# EAGLE design Mainboard 12-13 (EAGLE 5.11)
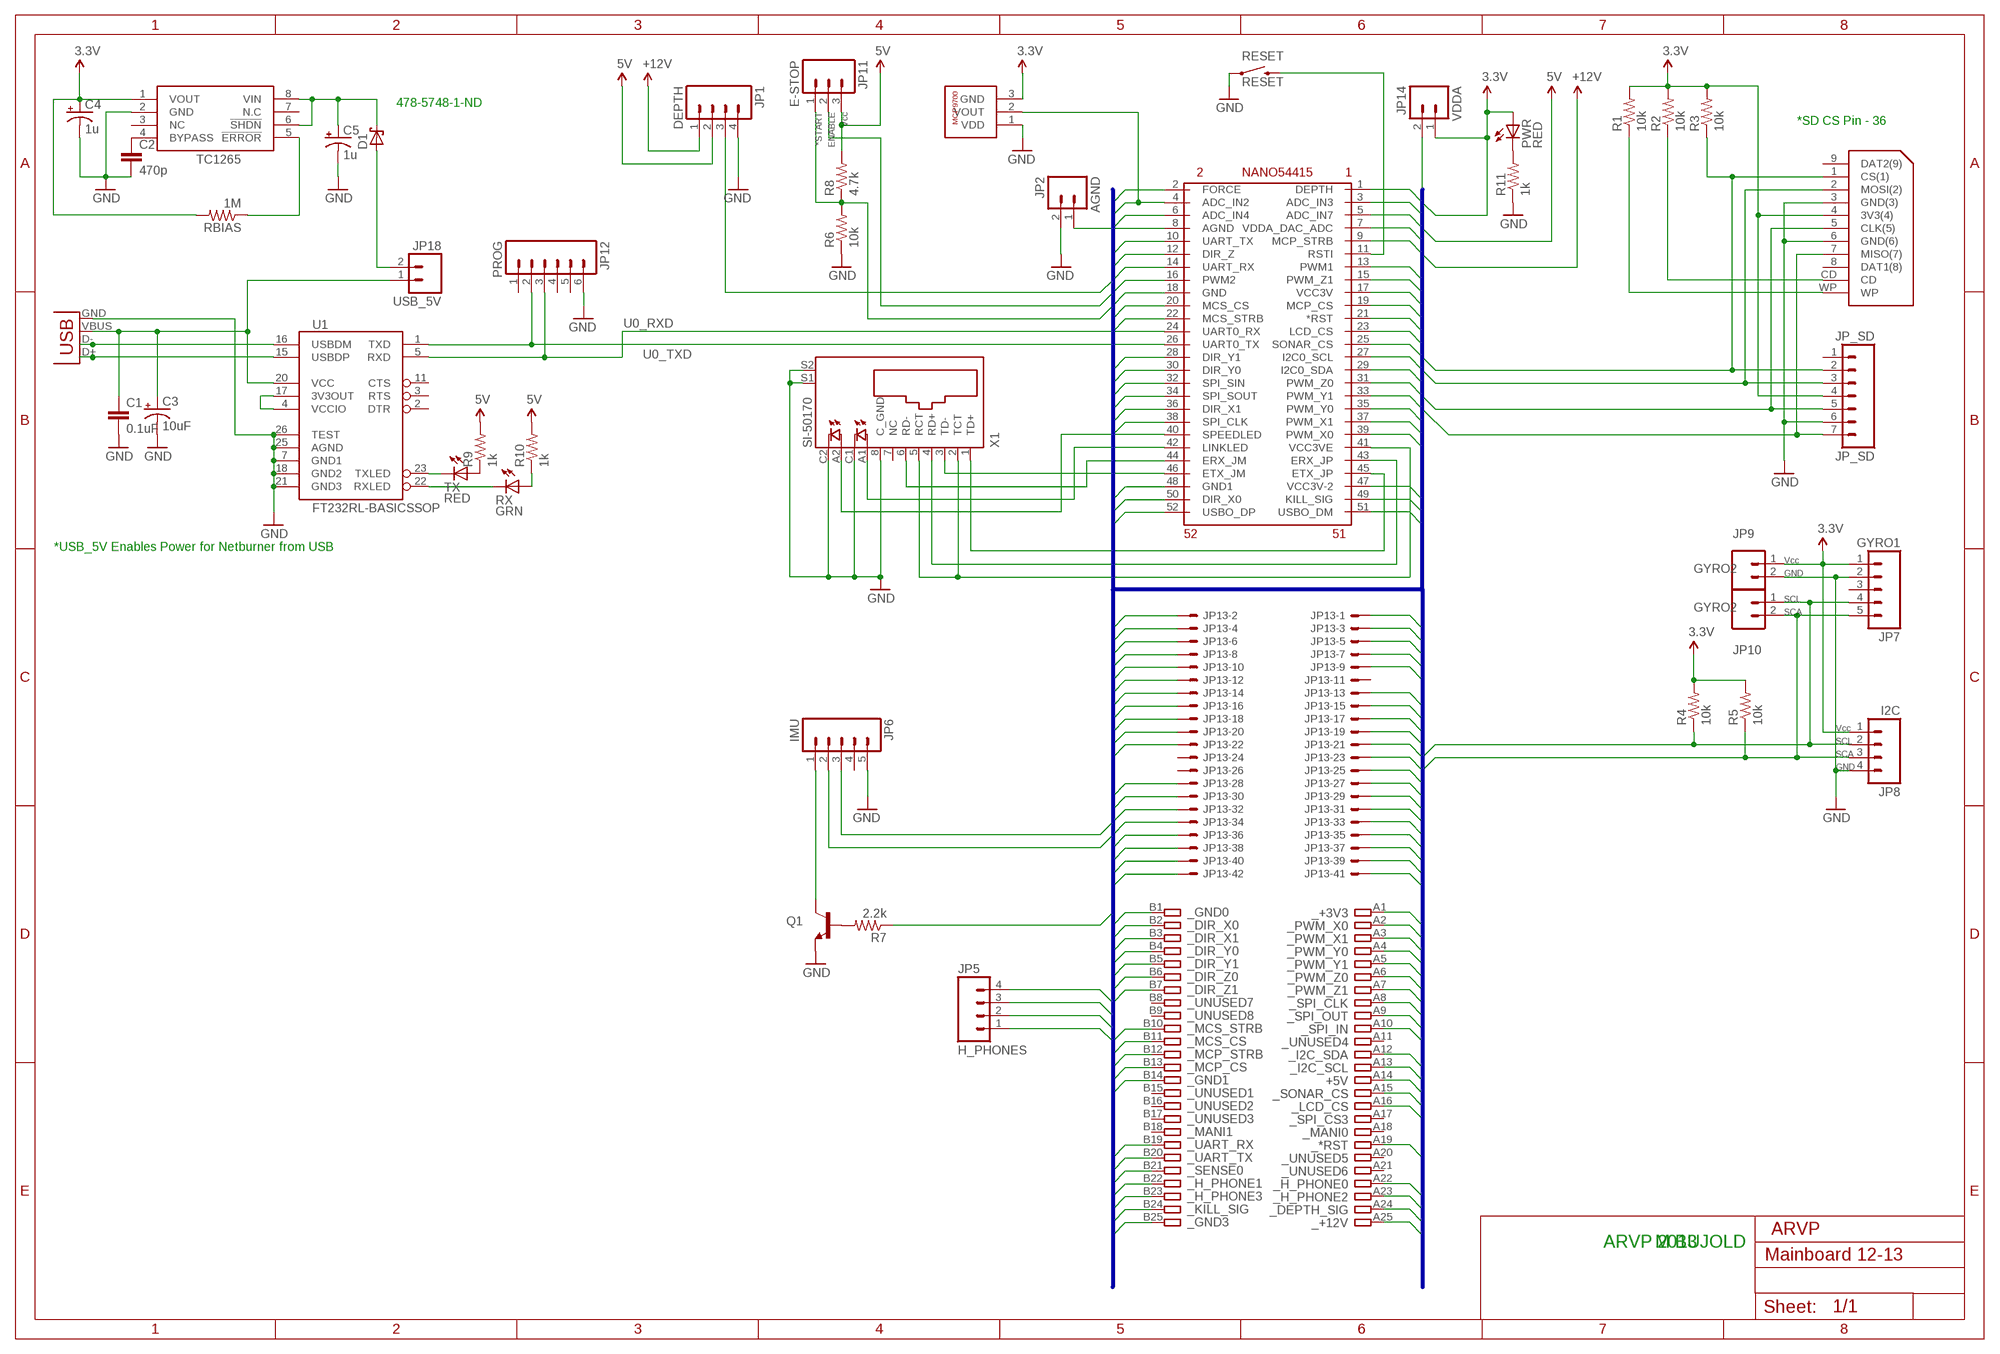
[diagram p0: schematic, sheet 1]

## Parts
C1  0.1uF  CAP1206  [1206]
C2  470p  C-EUC1206  [C1206]
C3  10uF  CAP_POL1206  [EIA3216]
C4  1u  CAP_POL1206  [EIA3216]
C5  1u  CAP_POL1206  [EIA3216]
D1  1N5817-B  [DO41-7.6]
JP1  DEPTH  M04LOCK_LONGPADS  [1X04_LOCK_LONGPADS]
JP2  AGND  M02LOCK  [1X02_LOCK]
JP5  H_PHONES  M04LOCK_LONGPADS  [1X04_LOCK_LONGPADS]
JP6  IMU  M05LOCK_LONGPADS  [1X05_LOCK_LONGPADS]
JP7  GYRO1  M05LOCK  [1X05_LOCK]
JP8  I2C  M04LOCK_LONGPADS  [1X04_LOCK_LONGPADS]
JP9  GYRO2  M02PTH  [1X02]
JP10  GYRO2  M02PTH  [1X02]
JP11  E-STOP  M03LOCK_LONGPADS  [1X03_LOCK_LONGPADS]
JP12  PROG  M06LOCK  [1X06_LOCK]
JP13  42PIN_BREAKOUT  [42PIN_BREAKOUT]
JP14  VDDA  M02LOCK  [1X02_LOCK]
JP18  USB_5V  M02LOCK  [1X02_LOCK]
JP_SD  JP_SD  M07LOCK  [1X07_LOCK]
PWR  RED  LED3MM  [LED3MM]
Q1  TRANSISTOR_NPNTO-92-AMMO  [TO-92-AMMO]
R1  10k  RESISTOR1206  [1206]
R2  10k  RESISTOR1206  [1206]
R3  10k  RESISTOR1206  [1206]
R4  10k  RESISTOR1206  [1206]
R5  10k  RESISTOR1206  [1206]
R6  10k  RESISTOR1206  [1206]
R7  2.2k  RESISTOR1206  [1206]
R8  4.7k  RESISTOR1206  [1206]
R9  1k  RESISTOR1206  [1206]
R10  1k  RESISTOR1206  [1206]
R11  1k  RESISTOR1206  [1206]
RBIAS  1M  RESISTOR1206  [1206]
RESET  SWITCH-MOMENTARY-2PTH  [TACTILE-PTH]
RX  GRN  LED3MM  [LED3MM]
TC1265  TC1265  [SO-08]
TX  RED  LED3MM  [LED3MM]
U1  FT232RL-BASICSSOP  [SSOP28DB]
U$1  NANO54415  [MINIPCI_EXPRESS]
U$2  SD_CARD  [SD_CARD]
U$5  CARD_50PIN  [CARD_50PIN]
U$6  MCP9700  [TO-92]
U$7  ARVP_LOGO  [ARVP]
X1  SI-50170  [SI-50170]
X2  USB-SMD-NS  [USB-MINIB-NOSTOP]

## Nets
3.3V: C4.A(+) JP7.1 JP8.1 JP9.1 JP_SD.4 R1.2 R2.2 R3.2 R4.2 R5.2 RBIAS.2 TC1265.1(VOUT) U$2.4(3V3(4)) U$6.3(GND)
3.7V_AD: C5.A(+) D1.C TC1265.6(!SHDN) TC1265.8(VIN)
3V3: JP13.J1[17] JP14.1 PWR.A U$1.17(VCC3V) U$1.47(VCC3V-2) U$5.A1 ; supply symbol labelled 3.3V
5V: JP1.2 JP11.3 R8.2 R9.2 R10.2 U$5.A14
12V: JP1.1 U$5.A25 ; supply symbol labelled +12V
*RST: JP13.J1[21] R7.1 U$1.21(*RST) U$5.A19
*RSTI: RESET.3 U$1.11(RSTI)
*START: JP11.1 R6.2 R8.1
ADC_IN2: JP13.J1[4] U$1.4(ADC_IN2) U$6.2(VOUT)
ADC_IN3: JP13.J1[3] U$1.3(ADC_IN3)
ADC_IN4: JP13.J1[6] U$1.6(ADC_IN4)
ADC_IN7: JP13.J1[5] U$1.5(ADC_IN7)
AGND: JP13.J1[8]
DEPTH_SIG: JP1.3 JP13.J1[1] U$1.1(DEPTH) U$5.A24
DIR_X0: JP13.J1[40] U$1.50(DIR_X0) U$5.B2
DIR_X1: JP13.J1[36] U$1.36(DIR_X1) U$5.B3
DIR_Y0: JP13.J1[30] U$1.30(DIR_Y0) U$5.B4
DIR_Y1: JP13.J1[28] U$1.28(DIR_Y1) U$5.B5
DIR_Z0: JP13.J1[12] U$1.12(DIR_Z) U$5.B6 U$5.B7
GND: C1.2 C2.2 C3.C(-) C4.C(-) C5.C(-) JP1.4 JP2.2 JP6.5 JP7.2 JP8.4 JP9.2 JP12.6 JP13.J1[18] JP_SD.6 Q1.1(E) R6.1 R11.1 RESET.1 TC1265.2(GND) U1.7(GND1) U1.18(GND2) U1.21(GND3) U1.25(AGND) U1.26(TEST) U$1.18(GND) U$1.48(GND1) U$2.3(GND(3)) U$2.6(GND(6)) U$5.B1 U$5.B14 U$5.B25 U$6.1(VDD) X1.8(C_GND) X1.C1(C) X1.C2(C1) X1.S1 X1.S2 X2.GND
H_PHONE0: JP5.1 U$5.A22
H_PHONE1: JP5.2 U$5.B22
H_PHONE2: JP5.3 U$5.A23
H_PHONE3: JP5.4 U$5.B23
I2C_SCL: JP7.4 JP8.2 JP10.1 JP13.J1[27] R4.1 U$1.27(I2C0_SCL) U$5.A13
I2C_SDA: JP7.5 JP8.3 JP10.2 JP13.J1[29] R5.1 U$1.29(I2C0_SDA) U$5.A12
KILL_SIG: JP11.2 U$1.49(KILL_SIG) U$5.B24
MCP_CS: JP13.J1[19] U$1.19(MCP_CS) U$5.B13
MCP_STRB: JP13.J1[9] U$1.9(MCP_STRB) U$5.B12
MCS_CS: JP13.J1[20] U$1.20(MCS_CS) U$5.B11
MCS_STRB: JP13.J1[22] U$1.22(MCS_STRB) U$5.B10
N$1: C1.1 C3.A(+) JP18.1 U1.20(VCC) X2.VBUS
N$2: C2.1 TC1265.4(BYPASS)
N$4: PWR.K(C) R11.2
N$5: D1.A JP18.2
N$6: U1.15(USBDP) X2.D+
N$8: TX.K(C) U1.23(TXLED)
N$9: RX.K(C) U1.22(RXLED)
N$10: JP6.1 Q1.3(C)
N$11: JP2.1 U$1.8(AGND)
N$12: R9.1 TX.A
N$13: U$1.46(ETX_JM) X1.3(TD-)
N$14: U$1.45(ETX_JP) X1.1(TD+)
N$15: U$1.43(ERX_JP) X1.4(RD+)
N$16: RBIAS.1 TC1265.5(!ERROR)
N$17: U$1.44(ERX_JM) X1.6(RD-)
N$18: R10.1 RX.A
N$19: U1.4(VCCIO) U1.17(3V3OUT)
N$20: U$1.42(LINKLED) X1.A1(A)
N$22: R2.1 U$2.CD
N$23: Q1.2(B) R7.2
N$24: R1.1 U$2.WP
N$25: U$1.40(SPEEDLED) X1.A2(A1)
N$26: U$1.41(VCC3VE) X1.2(TCT) X1.5(RCT)
PROG: U1.16(USBDM) X2.D-
PWM1: JP13.J1[13] U$1.13(PWM1)
PWM2: JP13.J1[16] U$1.16(PWM2)
PWM_X0: JP13.J1[39] U$1.39(PWM_X0) U$5.A2
PWM_X1: JP13.J1[37] U$1.37(PWM_X1) U$5.A3
PWM_Y0: JP13.J1[35] U$1.35(PWM_Y0) U$5.A4
PWM_Y1: JP13.J1[33] U$1.33(PWM_Y1) U$5.A5
PWM_Z0: JP13.J1[31] U$1.31(PWM_Z0) U$5.A6
PWM_Z1: JP13.J1[15] U$1.15(PWM_Z1) U$5.A7
SENSE0: JP13.J1[2] U$1.2(FORCE) U$5.B21
SPI_CLK: JP13.J1[38] JP_SD.5 U$1.38(SPI_CLK) U$2.5(CLK(5)) U$5.A8
SPI_CS0: JP_SD.2 R3.1 U$2.1(CS(1))
SPI_CS1: JP13.J1[25] U$1.25(SONAR_CS) U$5.A15
SPI_CS2: JP13.J1[23] U$1.23(LCD_CS) U$5.A16
SPI_IN: JP13.J1[32] U$1.32(SPI_SIN) U$5.A10
SPI_OUT: JP13.J1[34] JP_SD.3 JP_SD.7 U$1.34(SPI_SOUT) U$2.2(MOSI(2)) U$2.7(MISO(7)) U$5.A9
U0_RXD: JP12.3 U1.5(RXD) U$1.24(UART0_RX)
U0_TXD: JP12.2 U1.1(TXD) U$1.26(UART0_TX)
UART_RX: JP6.3 JP13.J1[14] U$1.14(UART_RX) U$5.B19
UART_TX: JP6.2 JP13.J1[10] U$1.10(UART_TX) U$5.B20
USB0_DM: JP13.J1[41] U$1.51(USBO_DM)
USB0_DP: JP13.J1[42] U$1.52(USBO_DP)
VDDA_DAC_ADC: JP13.J1[7] JP14.2 U$1.7(VDDA_DAC_ADC)
Unconnected: JP6.4 JP7.3 JP12.1 JP12.4 JP12.5 JP13.J1[11] JP13.J1[24] JP13.J1[26] JP_SD.1 TC1265.3(NC) TC1265.7(N.C) U1.2(DTR) U1.3(RTS) U1.11(CTS) U$2.8(DAT1(8)) U$2.9(DAT2(9)) U$5.A11 U$5.A17 U$5.A18 U$5.A20 U$5.A21 U$5.B8 U$5.B9 U$5.B15 U$5.B16 U$5.B17 U$5.B18 X1.7(NC)

## Buses
5V,DIR_X0,DIR_X1,DIR_Y0,DIR_Y1,DIR_Z0,DIR_Z1,UART_TX,UART_RX,MCP_CS,MCP_STRB,MCS_CS,MCS_STRB,GND,SPI_CS0,SPI_CS1,SPI_CS2,_SPI_CS3,MANI1,SENSE0,SPARE3,SPARE5,H_PHONE1,H_PHONE3,DEPTH_SIG,12V,KILL_SIG,H_PHONE2,H_PHONE0,SPARE4,SPARE2,MANI2,MANI0,SPI_CLK,SPI_OUT,SPI_IN,I2C_SCL,I2C_SDA,PWM_X0,PWM_X1,PWM_Y0,PWM_Y1,PWM_Z0,PWM_Z1,3V3,*START,*RST,ADC_IN2,ADC_IN4,PWM2,USB0_DP,ADC_IN3,ADC_IN7,VDDA_DAC_ADC,PWM1,USB0_DM,AGND

## Notes on the sheet
- RESET
- 478-5748-1-ND
- *START | ENABLE | Vcc
- *SD CS Pin - 36
- *USB_5V Enables Power for Netburner from USB
- Vcc
- GND
- SCL
- SCA
- Vcc
- SCL
- SCA
- GND
- ARVP 2013 | M BUJOLD

## Library data of the parts
C1 = SparkFun:CAP: Capacitor Standard 0603 ceramic capacitor, and 0.1" leaded capacitor.
C2 = rcl:C-EU: CAPACITOR, European symbol
C3-C5 = SparkFun:CAP_POL: Capacitor Polarized These are standard SMD and PTH capacitors. Normally 10uF, 47uF, and 100uF in electrolytic and tantalum varieties. Always verify the external diameter of the through hole cap, it varies with capacity, voltage, and manufacturer. The EIA devices should be standard.
D1 = diode:1N581*: 1.0A SCHOTTKY BARRIER RECTIFIER Source: http://www.diodes.com/datasheets/ds23001.pdf
JP1 JP5 JP8 = SparkFun:M04: Header 4 Standard 4-pin 0.1" header. Use with straight break away headers (SKU : PRT-00116), right angle break away headers (PRT-00553), swiss pins (PRT-00743), machine pins (PRT-00117), and female headers (PRT-00115). Molex polarized connector foot print use with SKU : PRT-08231 with associated crimp pins and housings. 1MM SMD Version SKU: PRT-10208
JP2 JP9 JP10 JP14 JP18 = SparkFun:M02: Header 2 Standard 2-pin 0.1" header. Use with straight break away headers (SKU : PRT-00116), right angle break away headers (PRT-00553), swiss pins (PRT-00743), machine pins (PRT-00117), and female headers (PRT-00115). Molex polarized connector foot print use with SKU : PRT-08233 with associated crimp pins and housings.
JP6 JP7 = SparkFun:M05: Header 5 Standard 5-pin 0.1" header. Use with straight break away headers (SKU : PRT-00116), right angle break away headers (PRT-00553), swiss pins (PRT-00743), machine pins (PRT-00117), and female headers (PRT-00115). Molex polarized connector foot print use with SKU : PRT-08230 with associated crimp pins and housings.
JP11 = SparkFun:M03: Header 3 Standard 3-pin 0.1" header. Use with straight break away headers (SKU : PRT-00116), right angle break away headers (PRT-00553), swiss pins (PRT-00743), machine pins (PRT-00117), and female headers (PRT-00115). Molex polarized connector foot print use with SKU : PRT-08232 with associated crimp pins and housings.
JP12 = SparkFun:M06: Header 6 Standard 6-pin 0.1" header. Use with straight break away headers (SKU : PRT-00116), right angle break away headers (PRT-00553), swiss pins (PRT-00743), machine pins (PRT-00117), and female headers (PRT-00115). Molex polarized connector foot print use with SKU : PRT-08094 with associated crimp pins and housings. NOTES ON THE VARIANTS LOCK and LOCK_LONGPADS... This footprint was designed to help hold the alignment of a through-hole component (i.e. 6-pin header) while soldering it into place. You may notice that each hole has been shifted either up or down by 0.005 of an inch from it's more standard position (which is a perfectly straight line). This slight alteration caused the pins (the squares in the middle) to touch the edges of the holes. Because they are alternating, it causes a "brace" to hold the component in place. 0.005 has proven to be the perfect amount of "off-center" position when using our standard breakaway headers. Although looks a little odd when you look at the bare footprint, once you have a header in there, the alteration is very hard to notice. Also, if you push a header all the way into place, it is covered up entirely on the bottom side. This idea of altering the position of holes to aid alignment will be further integrated into the Sparkfun Library for other footprints. It can help hold any component with 3 or more connection pins.
JP13 = ARVP:42PIN_BREAKOUT
JP_SD = SparkFun:M07: Header 7 Standard 7-pin 0.1" header. Use with straight break away headers (SKU : PRT-00116), right angle break away headers (PRT-00553), swiss pins (PRT-00743), machine pins (PRT-00117), and female headers (PRT-00115). NOTES ON THE VARIANTS LOCK and LOCK_LONGPADS... This footprint was designed to help hold the alignment of a through-hole component (i.e. 7-pin header) while soldering it into place. You may notice that each hole has been shifted either up or down by 0.005 of an inch from it's more standard position (which is usually a perfectly straight line). This slight alteration caused the pins (the squares in the middle) to touch the edges of the holes. Because they are alternating, it causes a "brace" to hold the header in place. 0.005 has proven to be the perfect amount of "off-center" position when using our standard breakaway headers. Although looks a little odd when you look at the bare footprint, once you have a header in there, the alteration is very hard to notice. Also, if you push a header all the way into place, it is covered up entirely on the bottom side. This idea of altering the position of holes to aid alignment will be further integrated into the Sparkfun Library for other footprints. It can help hold any component with 3 or more connection pins.
PWR RX TX = SparkFun:LED: LEDs Standard schematic elements and footprints for 5mm, 3mm, 1206, and 0603 sized LEDs. 5mm - Spark Fun Electronics SKU : COM-00529 (and others)
Q1 = SparkFun:TRANSISTOR_NPN: Transistor NPN BJT configuration in SOT23 package. MMBT2222 is the common NPN we use. Double check BCE configuration again layout.
R1-R11 RBIAS = SparkFun:RESISTOR: Resistor Basic schematic elements and footprints for 0603, 1206, and PTH 1/10th watt (small) resistors.
RESET = SparkFun:SWITCH-MOMENTARY-2
TC1265 = ARVP:TC1265
U1 = SparkFun:FT232RL-BASIC: USB UART This is the simplified version of the FT232RL unit. Only what you need, nothing you don't. Spark Fun Electronics SKU : COM-00650
U$1 = ARVP:NANO54415
U$2 = ARVP:SD_CARD
U$5 = ARVP:CARD_50PIN
U$6 = ARVP:MCP9700
U$7 = ARVP:ARVP_LOGO
X1 = con-stewart:SI-50170: Ethernet Connector MagJack (R) Source: www.stewartconnector.com .. si-50170.pdf; OC_FARNELL: unknown; OC_NEWARK: unknown
X2 = SparkFun:USB: USB Connectors USB-B-PTH is fully proven SKU : PRT-00139 USB-miniB is fully proven SKU : PRT-00587 USB-A-PCB is untested. USB-A-H is throughly reviewed, but untested. Spark Fun Electronics SKU : PRT-00437 USB-B-SMT is throughly reviewed, but untested. Needs silkscreen touching up. USB-A-S has not been used/tested USB-MB-H has not been used/tested

## Board
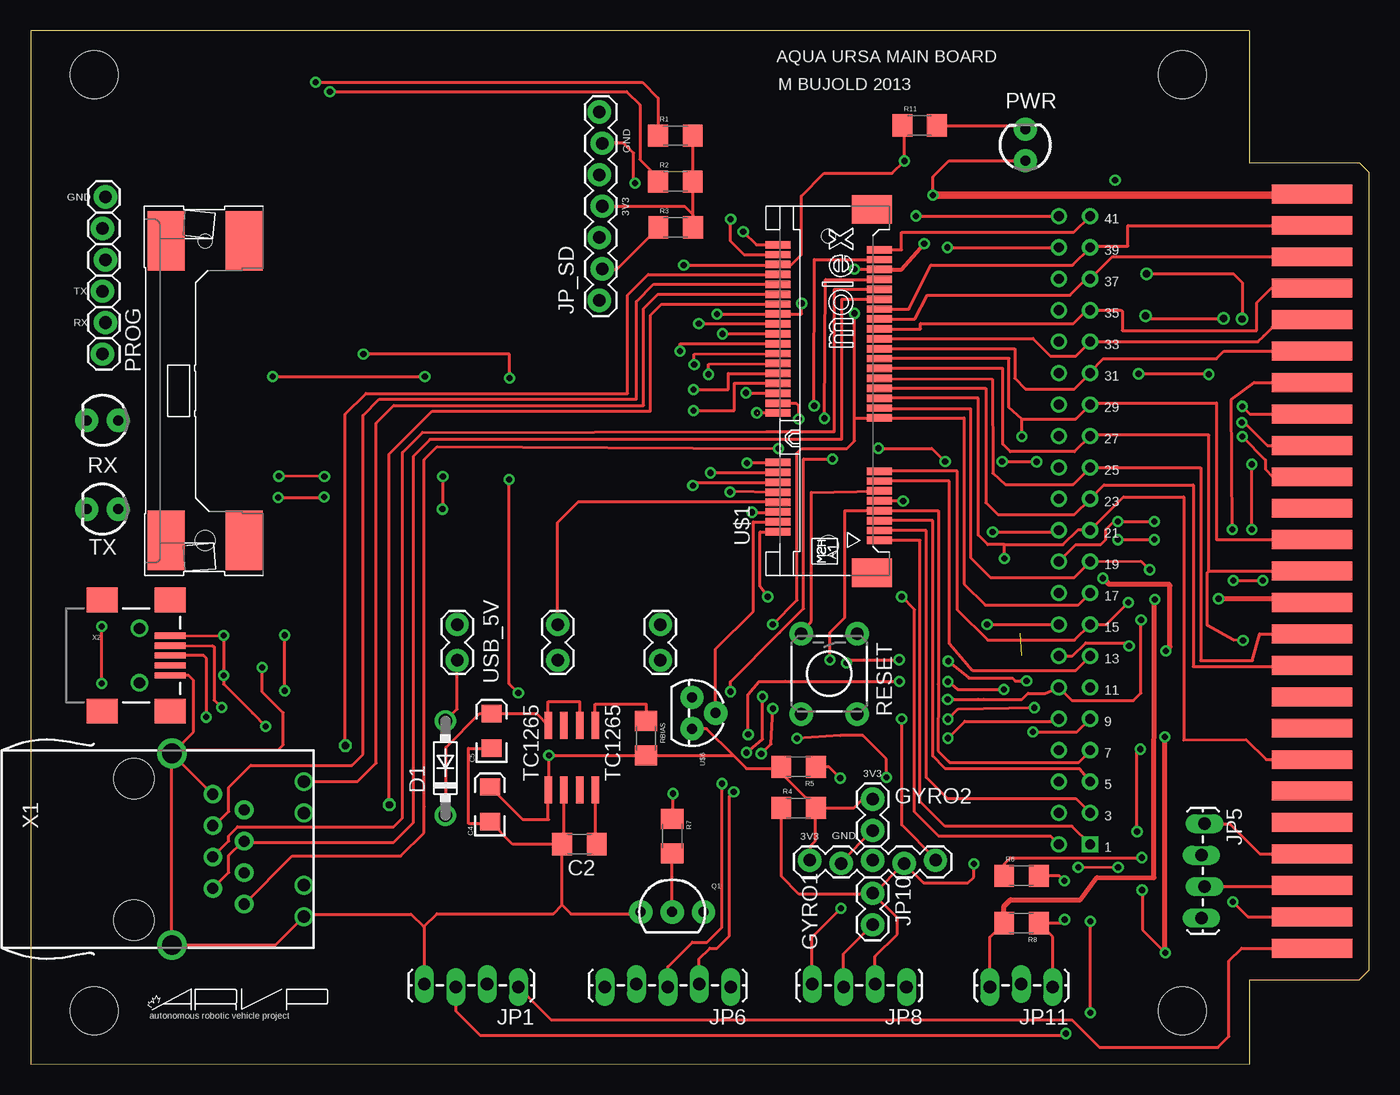
[diagram p1: board, top side]
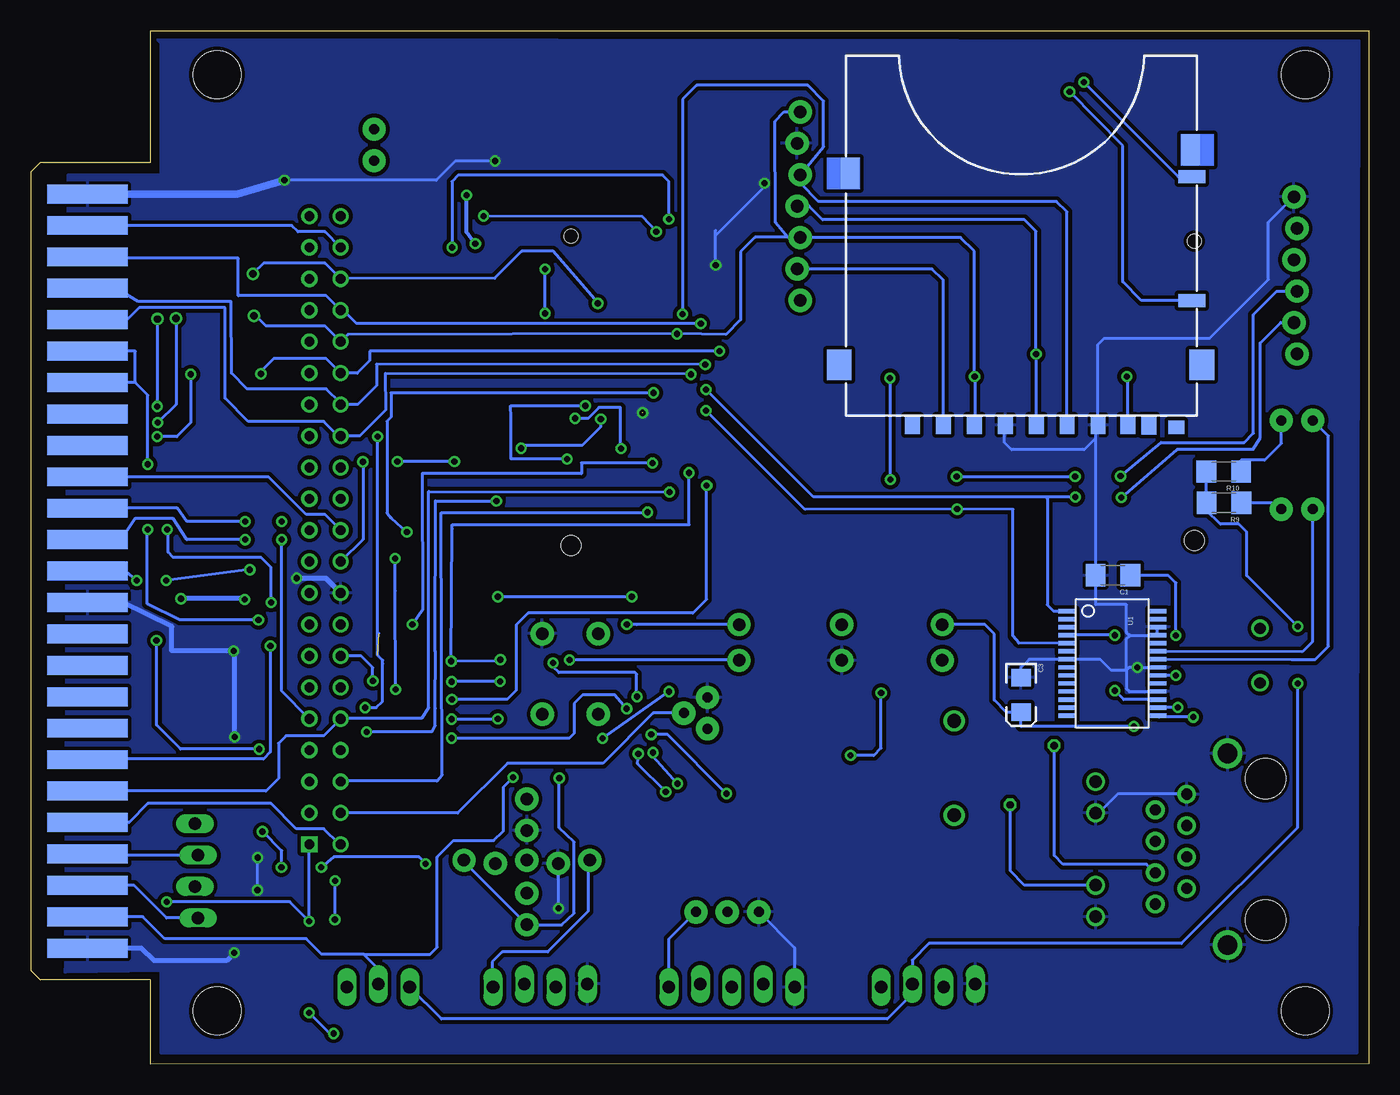
[diagram p2: board, bottom side, seen from below]

Size 108.12 x 83.51 mm. Coordinates in mm from the lower left corner, seen from the top.
Outline: 98.46,4.34 98.46,0 0,0.02 0,83.51 98.46,83.51 98.46,75.41
Copper layers (1*16): Top 0.035mm / dielectric 1.5mm / Bottom 0.035mm
Design rules "default *": minimum track width 10mil, minimum drill 19mil, track to track 7mil, track to pad 7mil, pad to pad 7mil, via to via 7mil, smd to smd 7mil, copper to edge 10mil, drill to drill 8mil, minimum pad ring 10mil, minimum via ring 8mil, stop-mask expansion 4mil, vias tented up to drill 0mil, thermal gap 10mil
Holes 3.86 mm at 93.08,79.98 93.08,4.29 5.12,79.98 5.12,4.29

### Footprints (pad centres in the part's own frame; a part is rotated, then mirrored left to right if it is on the bottom)
1206 = smd 1.6 x 1.8: 1 -1.4,0; 2 1.4,0
C1206 = smd 1.6 x 1.8: 1 -1.4,0; 2 1.4,0
EIA3216 = smd 1.4 x 1.6: A 1.4,0; C -1.4,0
DO41-7.6 = drill 1.1 pad 1.7 round: A 3.81,0; C -3.81,0
1X04_LOCK_LONGPADS = drill 1.016 long: 1 0,0; 2 2.54,-0.254; 3 5.08,0; 4 7.62,-0.254
1X02_LOCK = drill 1.016 pad 1.88 round: 1 -0.178,0; 2 2.718,0
1X05_LOCK_LONGPADS = drill 1.016 long: 1 0,0; 2 2.54,-0.254; 3 5.08,0; 4 7.62,-0.254; 5 10.16,0
1X05_LOCK = drill 1.016 pad 1.88 round: 1 0,0.127; 2 2.54,-0.127; 3 5.08,0.127; 4 7.62,-0.127; 5 10.16,0.127
1X02 = drill 1.016 pad 1.88 round: 1 0,0; 2 2.54,0
1X03_LOCK_LONGPADS = drill 1.016 long: 1 0,0; 2 2.54,-0.254; 3 5.08,0
1X06_LOCK = drill 1.016 pad 1.88 round: 1 0,0; 2 2.54,-0.254; 3 5.08,0; 4 7.62,-0.254; 5 10.16,0; 6 12.7,-0.254
42PIN_BREAKOUT = drill 0.8 square: J1[1] -1.778,28.702 | drill 0.8 round: J1[2] 0.762,28.702; J1[3] -1.778,26.162; J1[4] 0.762,26.162; J1[5] -1.778,23.622; J1[6] 0.762,23.622; J1[7] -1.778,21.082; J1[8] 0.762,21.082; J1[9] -1.778,18.542; J1[10] 0.762,18.542; J1[11] -1.778,16.002; J1[12] 0.762,16.002; J1[13] -1.778,13.462; J1[14] 0.762,13.462; J1[15] -1.778,10.922; J1[16] 0.762,10.922; J1[17] -1.778,8.382; J1[18] 0.762,8.382; J1[19] -1.778,5.842; J1[20] 0.762,5.842; J1[21] -1.778,3.302; J1[22] 0.762,3.302; J1[23] -1.778,0.762; J1[24] 0.762,0.762; J1[25] -1.778,-1.778; J1[26] 0.762,-1.778; J1[27] -1.778,-4.318; J1[28] 0.762,-4.318; J1[29] -1.778,-6.858; J1[30] 0.762,-6.858; J1[31] -1.778,-9.398; J1[32] 0.762,-9.398; J1[33] -1.778,-11.938; J1[34] 0.762,-11.938; J1[35] -1.778,-14.478; J1[36] 0.762,-14.478; J1[37] -1.778,-17.018; J1[38] 0.762,-17.018; J1[39] -1.778,-19.558; J1[40] 0.762,-19.558; J1[41] -1.778,-22.098; J1[42] 0.762,-22.098
1X07_LOCK = drill 1.016 pad 1.88 round: 1 0,0.127; 2 2.54,-0.127; 3 5.08,0.127; 4 7.62,-0.127; 5 10.16,0.127; 6 12.7,-0.127; 7 15.24,0.127
LED3MM = drill 0.813 pad 1.88 round: A -1.27,0; K 1.27,0
TO-92-AMMO = drill 0.813 pad 1.88 round: 1 -2.54,0; 2 0,0; 3 2.54,0
TACTILE-PTH = drill 1.016 pad 1.88 round: 1 -3.251,2.261; 2 3.251,2.261; 3 -3.251,-2.261; 4 3.251,-2.261
SO-08 = smd 0.6 x 2.2: 1 -1.905,-2.6; 2 -0.635,-2.6; 3 0.635,-2.6; 4 1.905,-2.6; 5 1.905,2.6; 6 0.635,2.6; 7 -0.635,2.6; 8 -1.905,2.6
SSOP28DB = smd 0.348 x 1.397: 1 -4.225,-3.656; 2 -3.575,-3.656; 3 -2.925,-3.656; 4 -2.275,-3.656; 5 -1.625,-3.656; 6 -0.975,-3.656; 7 -0.325,-3.656; 8 0.325,-3.656; 9 0.975,-3.656; 10 1.625,-3.656; 11 2.275,-3.656; 12 2.925,-3.656; 13 3.575,-3.656; 14 4.225,-3.656; 15 4.225,3.656; 16 3.575,3.656; 17 2.925,3.656; 18 2.275,3.656; 19 1.625,3.656; 20 0.975,3.656; 21 0.325,3.656; 22 -0.325,3.656; 23 -0.975,3.656; 24 -1.625,3.656; 25 -2.275,3.656; 26 -2.925,3.656; 27 -3.575,3.656; 28 -4.225,3.656
MINIPCI_EXPRESS = smd 0.6 x 2: 1 -12.3,-32.04; 2 -11.6,-23.84; 3 -11.5,-32.04; 4 -10.8,-23.84; 5 -10.7,-32.04; 6 -10,-23.84; 7 -9.9,-32.04; 8 -9.2,-23.84; 9 -9.1,-32.04; 10 -8.4,-23.84; 11 -8.3,-32.04; 12 -7.6,-23.84; 13 -7.5,-32.04; 14 -6.8,-23.84; 15 -6.7,-32.04; 16 -6,-23.84; 17 -2.4,-32.04; 18 -2,-23.84; 19 -1.6,-32.04; 20 -1.2,-23.84; 21 -0.8,-32.04; 22 -0.4,-23.84; 23 0,-32.04; 24 0.4,-23.84; 25 0.8,-32.04; 26 1.2,-23.84; 27 1.6,-32.04; 28 2,-23.84; 29 2.4,-32.04; 30 2.8,-23.84; 31 3.2,-32.04; 32 3.6,-23.84; 33 4,-32.04; 34 4.4,-23.84; 35 4.8,-32.04; 36 5.2,-23.84; 37 5.6,-32.04; 38 6,-23.84; 39 6.4,-32.04; 40 6.8,-23.84; 41 7.2,-32.04; 42 7.6,-23.84; 43 8,-32.04; 44 8.4,-23.84; 45 8.8,-32.04; 46 9.2,-23.84; 47 9.6,-32.04; 48 10,-23.84; 49 10.4,-32.04; 50 10.8,-23.84; 51 11.2,-32.04; 52 11.6,-23.84 | smd 2.3 x 3.2: M1 14.45,-31.44; M2 -14.9,-31.44 | smd 4.8 x 3: M3 -12.3,19.31; M4 -12.3,25.61; M5 11.9,19.31; M6 11.9,25.61 | hole 1.6: -12.7,-27.94; -12.3,22.46 | hole 1.1: 12.3,-27.94; 11.9,22.46
SD_CARD = smd 1.2 x 1.5: 1 6.88,12.07; 2 4.38,12.07; 3 1.88,12.07; 4 -0.62,12.07; 5 -3.12,12.07; 6 -5.62,12.07; 7 -8.04,12.07; 8 -9.728,12.09; 9 9.38,12.07 | smd 1.5 x 2.5: 12 -13.1,-10.18; 13 14.402,-8.255 | smd 2 x 2.5: 14 -14,7.22; 15 15.3,7.22 | smd 2.184 x 1.067: CD -13.18,2.02; WP -13.18,-7.98 | smd 1.3 x 1.1: SW -11.938,12.268
CARD_50PIN = smd 1.524 x 6.477: A1 63.5,3.81; A2 60.96,3.81; A3 58.42,3.81; A4 55.88,3.81; A5 53.34,3.81; A6 50.8,3.81; A7 48.26,3.81; A8 45.72,3.81; A9 43.18,3.81; A10 40.64,3.81; A11 38.1,3.81; A12 35.56,3.81; A13 33.02,3.81; A14 30.48,3.81; A15 27.94,3.81; A16 25.4,3.81; A17 22.86,3.81; A18 20.32,3.81; A19 17.78,3.81; A20 15.24,3.81; A21 12.7,3.81; A22 10.16,3.81; A23 7.62,3.81; A24 5.08,3.81; A25 2.54,3.81 | smd 1.524 x 6.477 bottom: B1 63.5,3.81; B2 60.96,3.81; B3 58.42,3.81; B4 55.88,3.81; B5 53.34,3.81; B6 50.8,3.81; B7 48.26,3.81; B8 45.72,3.81; B9 43.18,3.81; B10 40.64,3.81; B11 38.1,3.81; B12 35.56,3.81; B13 33.02,3.81; B14 30.48,3.81; B15 27.94,3.81; B16 25.4,3.81; B17 22.86,3.81; B18 20.32,3.81; B19 17.78,3.81; B20 15.24,3.81; B21 12.7,3.81; B22 10.16,3.81; B23 7.62,3.81; B24 5.08,3.81; B25 2.54,3.81
TO-92 = drill 0.813 pad 1.88 round: 1 -1.27,0; 2 0,1.905; 3 1.27,0
SI-50170 = drill 0.9 pad 1.5 round: 1 4.445,5.842; 2 3.175,3.302; 3 1.905,5.842; 4 0.635,3.302; 5 -0.635,5.842; 6 -1.905,3.302; 7 -3.175,5.842; 8 -4.445,3.302 | drill 1.016 pad 1.5 round: A1 -5.461,10.668; A2 2.921,10.668; C1 -2.921,10.668; C2 5.461,10.668 | drill 1.6 pad 2.2 round: S1 -7.747,0; S2 7.747,0 | hole 3.251: -5.715,-3.048; 5.715,-3.048
USB-MINIB-NOSTOP = smd 2.5 x 0.5: D+ 2.5,0; D- 2.5,0.8; GND 2.5,-1.6; ID 2.5,-0.8; VBUS 2.5,1.6 | smd 2.5 x 2: G1 -3,-4.5; G2 -3,4.5; G3 2.5,4.5; G4 2.5,-4.5 | drill 0.9 pad 0.8 round: H1 0,2.2 | drill 0.9 pad 0.787 round: H2 0,-2.2

### Placement (x,y rotation side)
C1  20.66,39.51 180 bottom
C2  44.33,17.77 180 top
C3  28.09,29.84 270 bottom
C4  37.1,21 90 top
C5  37.24,26.93 90 top
D1  33.5,23.92 90 top
JP1  39.41,6.22 180 top
JP2  42.58,35.35 270 top
JP5  94.86,19.43 270 top
JP6  56.55,6.22 180 top
JP7  62.95,16.34 0 top
JP8  70.77,6.22 180 top
JP9  68.03,21.42 270 top
JP10  68.03,13.8 270 top
JP11  82.59,6.22 180 top
JP12  5.78,57.39 90 top
JP13  83.83,46.45 180 top
JP14  50.88,35.35 270 top
JP18  34.45,35.35 270 top
JP_SD  46.06,61.73 90 top
PWR  80.38,74.3 90 top
Q1  51.83,12.29 0 top
R1  52.1,75.04 0 top
R2  52.1,71.33 0 top
R3  52.11,67.62 0 top
R4  62.05,20.7 0 top
R5  62.05,24.02 180 top
R6  80.06,15.22 0 top
R7  51.83,18.42 270 top
R8  80.06,11.4 180 top
R9  11.69,45.36 180 bottom
R10  11.7,47.89 180 bottom
R11  71.84,75.87 0 top
RBIAS  49.72,26.33 270 top
RESET  64.53,31.54 270 top
RX  5.78,52.03 180 top
TC1265  43.72,24.77 0 top
TX  5.78,44.85 180 top
U1  20.72,32.39 270 bottom
U$1  36.53,54.62 90 top
U$2  27.48,63.74 180 bottom
U$5  107.35,6.83 90 top
U$6  53.44,28.37 270 top
U$7  9.56,3.64 0 top
X1  11.39,17.37 270 top
X2  8.77,33.02 0 top

### Tracks (layer width: path | path; a pad name or v marks a point on that pad's centre or on a via)
3.3V  (via drill 0.5)  (1 unrouted)
  Top 0.254: R4.2 60.65,23.5 R5.2 60.52,23.9 57.82,23.9 56.79,24.93 | C4.A 39.74,19.76 41.84,19.76 41.82,19.79 TC1265.1 41.87,22.22 v41.87,24.94 | R2.2 R1.2 | R2.2 | R2.2 53.5,67.63 R3.2 53.51,68.66 52.84,69.33 46.21,69.33 JP_SD.4 | 50.25,24.93 RBIAS.2 | 50.25,24.93 56.79,24.93 | R4.2 66.51,20.7 67.23,21.42 JP9.1 | R4.2 63.38,20.63 63.38,18.02 62.95,17.59 JP7.1 | v26.87,57.38 38.68,57.38 v38.68,55.45 | v38.65,47.24 v38.66,47.24 38.66,30.73 v39.4,30 | v41.87,24.94 50.25,24.94 50.25,24.93 | 56.79,24.93 54.62,27.1 U$6.3
  Bottom 0.254: JP8.1 70.83,6.28 70.83,8.25 70.02,9.06 66.36,9.06 63.08,12.34 63.08,16.34 JP7.1 | JP_SD.4 45.23,69.35 44.13,68.24 27.81,68.24 26.87,67.31 v26.87,57.38 26.87,51.68 U$2.4 | v38.68,55.45 38.65,55.45 v38.65,47.24 | v39.4,30 39.4,25.54 40,24.94 v41.87,24.94
3.7V_AD
  Top 0.254: TC1265.6 44.36,29.3 41.82,29.3 TC1265.8 40.86,28.33 37.76,28.33 C5.A 36.27,28.33 33.54,25.6 33.54,20.16 D1.C
3V3  (via drill 0.5)
  Top 0.254: U$1.47 68.57,64.16 | JP13.J1[17] 84.65,37.1 77.13,37.1 75.43,38.81 75.43,52.22 U$1.17 66.56,52.22 | 66.56,52.22 v66.56,60.67 | U$1.47 68.57,64.13 | v66.57,64.25 68.55,64.25 U$1.47 | 66.56,52.22 66.56,50.36 65.95,49.75 62.28,49.75 61.92,49.37 61.92,37.5 v59.96,35.54 | v72.91,70.22 72.91,71.72 74.21,73.01 80.36,73.01 PWR.A
  Top 0.305: 68.6,64.26 U$1.47 70.37,64.22 v72.2,66.31
  Top 0.61: U$5.A1 103.44,70.22 v72.91,70.22
  Bottom 0.254: v66.56,60.67 v66.57,64.25 | JP14.1 59.16,35.53 59.17,35.54 v59.96,35.54
  Bottom 0.305: v72.2,66.31 72.91,67.28 v72.91,70.22
5V  (via drill 0.5)
  Top 0.254: R8.2 77.51,10.25 JP11.3 | v5.73,30.76 v5.73,35.36
  Top 0.406: U$5.A14 103.54,37.61 v95.99,37.61 | v90.84,37.56 90.79,37.56 90.77,15.07 86.17,15.07 84.81,13.29 79.18,13.29 78.66,12.77 R8.2
  Bottom 0.254: JP11.3 74.94,3.65 38.9,3.65 36.87,5.68 JP1.2 36.87,8.4 35.52,9.75 15.13,9.75 5.73,19.14 v5.73,30.76 | R10.2 R9.2 13.09,44.74 11.98,43.63 10.47,43.63 9.85,43.01 9.85,39.48 v5.73,35.36
  Bottom 0.406: v95.99,37.61 90.84,37.61 v90.84,37.56
12V
  Top 0.254: JP1.1 42.06,3.57 84.15,3.57 86.37,1.35 95.94,1.35 96.83,2.24 96.83,8.32 97.87,9.37 U$5.A25
*RST  (via drill 0.5)
  Top 0.254: U$1.21 76.57,53.82 76.57,42.74 77.33,41.98 78.69,41.98 | U$5.A19 99.84,24.61 98.21,26.23 93.18,26.18 93.18,45.84 88.3,45.84 JP13.J1[21] 85.56,43.2 84.65,43.2 83.43,41.98 78.69,41.98 | v78.69,40.86 78.69,41.98 | v78.65,30.27 74.9,30.28 v74.12,30.91 | v70.19,30.93 60.97,30.93 60.95,30.91 58.84,30.91 57.97,29.86 v57.97,26.63 | R7.1 51.89,19.88 v51.89,21.86
  Bottom 0.254: v78.69,40.86 78.67,40.86 78.67,38.27 78.69,38.27 v78.65,30.27 | v74.12,30.91 70.21,30.91 v70.19,30.93 | v51.89,21.86 56.66,26.63 v57.97,26.63
*RSTI
  Top 0.254: U$1.11 63.08,46.2 63.08,38.08 63.08,35.82 RESET.3
*START  (via drill 0.5)
  Top 0.254: JP11.1 82.59,10.27 R8.1 83.27,11.4 v83.55,11.68 | R6.2 83.11,15.22 v83.53,14.8
  Bottom 0.254: v83.53,14.8 83.53,11.71 v83.55,11.68
ADC_IN2
  Top 0.254: U$1.4 58.38,43.82 58.38,36.6 55.34,33.56 U$6.2
  Bottom 0.254: JP13.J1[4] 73.62,20.29 69.61,24.3 61.89,24.3 57.82,28.37 U$6.2
ADC_IN3
  Top 0.254: U$1.3 72.38,43.12 72.38,23.16 74.08,21.46 84.44,21.46 JP13.J1[3]
ADC_IN4  (via drill 0.5)
  Top 0.254: U$1.6 60.35,44.6 v58.28,44.6
  Bottom 0.254: v58.28,44.6 74.95,44.57 74.87,23.39 75.3,22.88 83.02,22.88 JP13.J1[6]
ADC_IN7
  Top 0.254: U$1.5 72.89,43.92 72.89,24.89 73.88,23.9 84.75,23.9 JP13.J1[5]
DEPTH_SIG  (via drill 0.5)
  Top 0.254: JP13.J1[1] 84.14,19.22 73.88,19.22 71.87,21.23 71.87,42.32 U$1.1 | v97.15,13.12 98.36,11.91 U$5.A24 | JP1.3 34.33,4.3 36.29,2.34 83.53,2.34 v83.65,2.46 | v85.62,4.15 v85.62,11.54
  Bottom 0.254: JP13.J1[1] v85.62,11.54 87.2,13.13 v97.15,13.12 | v83.65,2.46 83.94,2.46 v85.62,4.15
DIR_X0  (via drill 0.5)
  Top 0.254: U$1.50 57.65,65.42 56.55,66.52 v56.55,68.3 | v74.08,66.01 JP13.J1[40]
  Bottom 0.254: U$5.B2 87.03,67.79 86.53,67.28 84.34,67.28 JP13.J1[40] | v74.08,66.01 74.08,71.34 73.57,71.85 57.06,71.85 56.55,71.34 v56.55,68.3
DIR_X1  (via drill 0.5)
  Top 0.254: U$1.36 60.41,59.86 v53.97,59.86
  Bottom 0.254: U$5.B3 103.54,65.15 91.4,65.15 91.35,65.09 91.35,62.1 84.24,62.1 JP13.J1[36] 82.87,60.93 81.8,59.86 v53.97,59.86
DIR_Y0  (via drill 0.5)
  Top 0.254: U$1.30 53.61,57.38 v53.61,56.54
  Bottom 0.254: U$5.B4 101.21,62.71 99.43,61.63 91.94,61.63 91.91,55.85 90.64,54.58 84.24,54.58 83.07,53.41 JP13.J1[30] 81.7,53.31 80.18,54.83 80.18,56.57 v53.61,56.54
DIR_Y1  (via drill 0.5)
  Top 0.254: U$1.28 54.78,56.58 v54.76,55.75
  Bottom 0.254: U$5.B5 100.34,60.17 99.38,61.13 92.42,61.13 92.42,53.82 90.54,51.94 84.44,51.94 83.28,50.77 JP13.J1[28] 81.55,50.77 79.47,52.85 79.48,55.82 v54.76,55.75
DIR_Z0  (via drill 0.5)
  Top 0.254: v98.67,43.2 v98.67,48.48 | v89.73,35.88 89.73,29.99 89.12,29.38 84.14,29.38 JP13.J1[12] 81.97,29.95 80.58,29.96 80.1,29.47 77,29.47 76.56,29.47 v74.09,29.47 | U$1.12 53.77,47.02 v53.5,46.76
  Bottom 0.254: U$5.B6 99.68,57.63 99.68,55.09 | 99.68,55.09 U$5.B7 | 99.68,55.09 98.67,54.07 v98.67,48.48 | v98.67,43.2 98.72,43.15 98.72,37.2 96.11,35.91 89.75,35.91 v89.73,35.88 | v53.5,46.76 53.5,37.56 54.6,36.46 67.93,36.46 68.89,35.49 68.89,30.21 69.63,29.47 v74.09,29.47
GND  (via drill 0.5)  (1 unrouted)
  Top 0.254: v52.77,64.59 60.33,64.59 U$1.48 61.48,64.62 62.28,65.43 62.28,70.16 64.12,72 69.6,72 v70.6,73 70.6,75.71 R11.1 | X1.S1 X1.S2 19.78,9.62 X1.C2 22.27,12.12 30.73,12.12 31.73,11.12 31.79,11.12 | X1.S1 X1.8 | JP7.2 65.49,16.34 JP9.2 | TC1265.2 43.09,17.93 C2.2 | C2.2 38.94,17.77 C4.C 36.92,19.42 35.39,19.42 35.36,19.45 35.36,25.53 C5.C 37.33,25.43 | 42.93,12.85 C2.2 | 42.93,12.85 43.65,12.13 49.13,12.13 Q1.1 | 42.93,12.85 42.22,12.14 32.82,12.14 31.79,11.12 | 31.79,11.12 JP1.4 | X2.GND 12.74,31.42 13.13,31.02 13.13,26.86 X1.S1 | JP_SD.6 47.91,74.43 48.71,73.63 48.71,71.34 v48.83,71.21 | v18.69,32.06 18.69,30.1 20.4,28.38 20.4,25.81 20,25.4 11.68,25.4 X1.S1 | R6.1 78.66,16.18 79.17,16.68 v89.79,16.68 89.84,16.64 | 58.71,52.62 58.71,52.63 | v58.67,52.64 60.37,52.64 U$1.18 | JP8.4 63.15,10.26 v65.48,12.59 | 91.66,9.01 91.66,9.04 89.84,10.86 89.84,14.04 v89.82,14.06
  Top 0.406: v86.65,39.27 87.16,38.76 91.97,38.76 92.06,38.67 92.06,33.73 v91.73,33.4 | v91.66,26.44 91.66,9.01 v91.68,8.98
  Bottom 0.254: U1.26 U1.25 19.27,34.66 | X1.8 14.72,21.84 20.26,21.84 21.81,20.29 X1.C1 | JP6.5 46.39,9.39 Q1.1 | 19.27,34.66 19.58,34.35 19.58,31.82 | 19.58,31.82 19.58,30.33 19.35,30.1 17.07,30.1 U1.18 | U1.21 v18.69,32.06 19.34,32.06 19.58,31.82 | 19.58,31.82 20.8,31.82 21.68,32.7 24.37,32.7 U1.7 27.42,32.71 28.12,32.01 28.12,31.28 C3.C | 19.27,34.66 arc90 19.57,34.96 19.57,37.14 22.06,37.14 C1.2 22.06,50.58 | 22.06,50.58 22.06,51.47 U$2.6 21.86,58.16 21.36,58.66 12.84,58.66 8.09,63.41 8.09,68.03 JP12.6 | 22.06,50.58 22.97,49.67 28.87,49.67 29.42,50.22 29.42,51.62 U$2.3 | 52.78,66.97 v52.78,64.59 v52.77,64.59 | 52.78,66.97 52.78,67.4 | v48.83,71.21 48.83,70.92 52.78,66.97 | 66.84,34.74 RESET.1 | v87.63,71.45 75.37,71.44 73.79,73.01 73.78,73 v70.6,73 | v65.48,12.59 65.48,16.2 JP7.2 | v89.82,14.06 89.82,16.66 v89.79,16.68
  Bottom 0.406: U$5.B14 100.65,37.31 96.78,35.4 96.74,35.36 96.74,33.4 v91.73,33.4 91.66,33.4 v91.66,26.44 | JP13.J1[18] 84.28,39.27 v86.65,39.27 | v91.68,8.98 92.31,8.35 98.17,8.35 99.19,9.37 U$5.B25
  Bottom 0.61: v87.63,71.45 91.43,70.33 U$5.B1
  pour Bottom (isolate 0.305): 97.64,0.92 0.91,0.92 0.73,82.68 97.92,82.81 97.64,82.53 97.64,71.91 105.14,71.86 105.36,8.09 105.39,7.42 105.3,7.46 97.64,7.59
H_PHONE0
  Top 0.254: U$5.A22 99.33,16.99 96.89,19.43 JP5.1
H_PHONE1
  Bottom 0.254: JP5.2 103.44,16.89 U$5.B22
H_PHONE2
  Top 0.254: JP5.3 103.44,14.35 U$5.A23
H_PHONE3
  Bottom 0.254: U$5.B23 99.79,14.45 97.14,11.8 JP5.4
I2C_SCL  (via drill 0.5)
  Top 0.254: U$1.27 78.55,56.22 78.55,50.11 79.16,49.5 84.34,49.5 JP13.J1[27] 85.61,50.83 95.21,50.83 95.21,39.85 | 95.21,39.85 U$5.A13 | JP10.1 68.16,13.8 JP7.4 72.14,14.65 75.75,14.65 76.21,15.11 v76.21,16.18 | R4.1 60.65,15.18 62.09,13.74 67.97,13.74 JP10.1 | JP8.2 68.23,8.69 70.02,10.48 70.02,11.82 JP10.1 | 95.21,39.85 95.09,39.73 95.09,35.44 97.2,34.27 v97.97,34.25 | v89.66,25.46 89.4,25.19 v89.4,18.79 | v84.65,15.89 84.67,15.92 v87.87,15.91
  Bottom 0.254: v97.97,34.25 97.96,33.52 97.96,27.4 96.02,25.46 v89.66,25.46 | v76.21,16.18 76.76,16.73 83.65,16.73 v84.65,15.89 84.63,15.83 | v89.4,18.79 87.85,17.24 v87.87,15.91
I2C_SDA  (via drill 0.5)  (1 unrouted)
  Top 0.254: 68.41,56.87 U$1.29 79.06,57.02 79.06,53.05 80.09,52.14 | JP7.5 73.11,16.59 70.38,19.32 v70.38,27.89 | U$5.A12 95.82,42.39 95.82,53.44 85.61,53.44 JP13.J1[29] 84.44,52.14 80.09,52.14 | v80.09,50.72 80.09,52.14 | JP10.2 65.69,8.92 JP8.3 | R5.1 64.5,24.02 v65.41,23.11 | v74.11,27.87 74.93,28.7 v81.12,28.81
  Bottom 0.254: JP7.5 73.11,16.34 JP10.2 68.01,11.24 65.21,11.24 64.21,12.18 64.21,17.94 65.41,19.1 v65.41,23.11 | v81.12,28.81 80.2,28.81 79.71,29.3 79.68,32.34 79.68,32.64 80.09,33.05 v80.09,50.72 | v70.38,27.89 70.4,27.87 v74.11,27.87 | 79.99,34.82
KILL_SIG  (via drill 0.5)
  Top 0.254: U$1.49 63.31,65.02 v63.31,53.21 | v64.79,48.91 62.46,48.91 62.46,36.82 60.5,34.87 56.54,30.9 v56.54,30.11 | v69.14,23.17 69.14,24.65 67.24,26.55 65.42,26.55 v61.92,26.31
  Bottom 0.254: U$5.B24 99.07,11.91 97.3,10.13 85.87,10.13 84.62,8.88 81.22,8.88 | 81.22,8.88 80.05,7.71 JP11.2 | v63.31,53.21 69.33,53.21 69.32,52.27 69.32,48.92 v64.79,48.91 | 81.22,8.88 75.84,8.88 75.28,9.45 75.28,16.74 73.96,18.06 70.71,18.06 69.92,18.84 69.92,22.39 v69.14,23.17 | v61.92,26.31 v56.54,30.11
MCP_CS  (via drill 0.5)
  Top 0.254: U$1.19 68.64,52.95 75.96,52.95 75.96,40.91 77.53,39.34 84.34,39.34 JP13.J1[19] 89.71,40.65 v90.43,39.96 | v97.19,39.09 v99.56,39.09
  Bottom 0.254: U$5.B13 100.45,39.85 v99.56,39.09 | v90.43,39.96 v97.19,39.09
MCP_STRB  (via drill 0.5)
  Top 0.254: v87.85,42.39 v90.79,42.39 | U$1.9 70.47,45.52 v70.5,45.51 | v80.99,26.86 84.56,26.86 JP13.J1[9]
  Bottom 0.254: v90.79,42.39 95.52,42.39 96.64,44.11 99.68,44.11 100.8,42.39 U$5.B12 | v70.5,45.51 75.42,45.53 75.44,33.34 75.41,33.37 75.44,28.76 75.44,28.73 75.44,27.33 75.69,26.86 v80.99,26.86 | v87.85,42.39 87.85,30.14 JP13.J1[9]
MCS_CS  (via drill 0.5)
  Top 0.254: v90.79,43.86 v87.85,43.86 87.54,43.86 86.88,43.2 86.88,42.39 86.48,41.98 84.44,41.98 JP13.J1[20] | v81.28,48.67 81.26,48.69 v78.5,48.69 | U$1.20 60.41,53.38 61.89,53.38 62.06,53.2 v62.06,52.13 | v68.49,49.77 72.82,49.77 v73.89,48.7
  Bottom 0.254: v90.79,43.86 95.52,43.86 96.28,44.93 U$5.B11 | JP13.J1[20] 81.28,42.4 v81.28,48.67 | 78.39,48.71 v78.5,48.69 78.59,48.7 v73.89,48.7 | v62.06,52.13 62.06,51.5 63.55,50.01 68.26,50.01 v68.49,49.77
MCS_STRB  (via drill 0.5)
  Top 0.254: U$1.22 57.77,54.22 v57.79,54.25 | v77.74,43 82.92,43 JP13.J1[22]
  Bottom 0.254: v57.79,54.25 79.01,54.25 79.01,52.28 79.33,51.97 79.33,44.57 79.32,44.56 78.99,44.14 v77.74,43 | JP13.J1[22] 84.34,44.42 85.87,44.42 88.91,47.47 U$5.B10
N$1  (via drill 0.5)
  Top 0.254: X2.VBUS 11.28,34.6 v15.58,34.65 v15.58,31.42 15.58,30.71 17.92,28.36 v18.98,27.29
  Bottom 0.254: v15.58,31.42 U1.20 | v18.98,27.29 28.09,27.29 C3.A 29.26,28.44 30.25,29.43 30.25,34.76 31.03,35.54 34.43,35.54 JP18.1 | v15.58,34.65 15.58,38.89 16.16,39.48 19.23,39.48 C1.1
N$2
  Top 0.254: TC1265.4 45.63,17.87 C2.1
N$4
  Top 0.254: R11.2 80.07,75.87 PWR.K
N$5
  Top 0.254: D1.A 34.45,28.68 JP18.2
N$6  (via drill 0.5)
  Top 0.254: X2.D+ 13.96,33.02 14.2,32.78 14.2,28.07 v14.17,28.04
  Bottom 0.254: v14.17,28.04 16.94,28.04 U1.15
N$8
  Bottom 0.254: U1.23 5.36,33.32 4.52,34.16 TX.K
N$9
  Bottom 0.254: U1.22 6.24,32.67 4.34,32.67 3.25,33.76 3.25,50.77 RX.K
N$10
  Bottom 0.254: Q1.3 56.55,10.1 JP6.1
N$11
  Top 0.254: JP2.1 42.58,43.79 44.25,45.45 60.35,45.45 U$1.8
N$12
  Bottom 0.254: TX.A 7.56,45.36 R9.1
N$13  (via drill 0.6)
  Top 0.254: U$1.46 49.89,63.82 48.23,62.17 48.23,54.2 27.09,54.2 25.41,52.52 v25.41,25.75
  Bottom 0.254: v25.41,25.75 25.41,16.86 24.7,16.15 17.95,16.15 17.26,15.46 X1.3
N$14  (via drill 0.5)
  Top 0.254: X1.1 21.12,16.81 29.89,16.81 31.77,18.69 31.77,20.8 31.78,20.8 31.78,48.84 32.83,49.9 v60.43,49.74 | U$1.45 64.23,63.42 v64.13,52.2
  Bottom 0.254: v60.43,49.74 60.48,49.82 60.48,53.07 62.2,53.07 63.08,52.19 v64.12,52.19 v64.13,52.2
N$15
  Top 0.254: X1.4 15.99,18.03 15.99,18.46 16.7,19.17 29.33,19.17 30.04,19.88 30.04,49.45 31.64,51.05 59.45,51.12 64.94,51.12 64.94,62.62 U$1.43
N$16
  Top 0.254: RBIAS.1 49.72,29.1 45.61,29.1 45.61,27.36 TC1265.5
N$17
  Top 0.254: U$1.44 50.33,63.02 48.95,61.64 48.95,53.74 28.16,53.74 26.84,52.42 26.84,25.04 25.95,24.15 17.77,24.15 15.99,22.37 15.99,20.42 14.85,19.27 X1.6
N$18
  Bottom 0.254: RX.A 7.05,50.17 8.4,48.81 10.3,48.81 R10.1
N$19  (via drill 0.5)
  Top 0.254: v20.5,30.17 v20.5,34.67
  Bottom 0.254: U1.17 19.79,29.46 v20.5,30.17 | v20.5,34.67 U1.4
N$20
  Top 0.254: U$1.42 50.67,62.22 49.53,61.08 49.53,53.23 29.33,53.23 27.9,51.81 27.9,24.33 26.4,22.83 X1.A1
N$22  (via drill 0.5)
  Top 0.254: 50.7,71.76 R2.1 50.7,71.64 49.22,73.12 49.22,77.53 48.16,78.61 v24.16,78.59
  Bottom 0.254: U$2.CD 18.36,61.72 19.88,63.24 19.88,74.22 v24.16,78.59
N$23
  Top 0.254: Q1.2 51.83,15.12 R7.2
N$24  (via drill 0.5)
  Top 0.254: R1.1 50.7,78.09 49.43,79.36 v23.01,79.36
  Bottom 0.254: U$2.WP 15.38,71.72 v23.01,79.36
N$25  (via drill 0.6)
  Top 0.254: U$1.40 50.97,61.42 50.06,60.52 50.06,52.78 32.42,52.78 28.97,49.32 v28.97,20.95
  Bottom 0.254: v28.97,20.95 28.97,15.62 27.8,14.45 X1.A2
N$26
  Top 0.254: 32.25,50.46 32.25,50.49 | X1.2 15.99,15.49 15.99,16.86 17.13,18 X1.5 17.31,17.93 29.33,17.93 30.93,19.53 30.93,49.14 32.25,50.46 | U$1.41 65.55,61.82 65.55,50.52 32.25,50.52 32.25,50.46
PROG  (via drill 0.5)
  Top 0.254: X2.D- 14.68,33.81 14.8,33.75 14.8,29.43 v15.41,28.82
  Bottom 0.254: v15.41,28.82 U1.16
PWM1
  Top 0.254: U$1.13 74.22,47.12 74.22,33.99 76.11,31.82 84.44,31.82 JP13.J1[13]
PWM2  (via drill 0.5)
  Top 0.254: U$1.16 57.88,48.62 v57.88,48.59 | v77.28,35.53 JP13.J1[16]
  Bottom 0.254: v57.88,48.59 63.62,48.59 63.62,47.72 76.48,47.74 76.45,36.72 v77.28,35.53
PWM_X0
  Top 0.254: U$5.A2 88.66,67.79 88.66,66.13 85.73,66.13 JP13.J1[39] 84.23,64.63 84.23,64.59 72.76,64.59 70.98,61.02 U$1.39
PWM_X1
  Top 0.254: U$1.37 71.44,60.22 72.45,62.15 83.99,62.15 85.31,63.47 JP13.J1[37] 87.39,65.25 U$5.A3 | U$5.A3 104.05,65.25 104.05,64.99 103.54,64.99 U$5.A3
PWM_Y0
  Top 0.254: U$1.35 71.9,59.42 71.9,59.86 84.27,59.86 85.34,60.93 JP13.J1[35] 88.13,60.93 88.2,60.86 88.2,59.3 99.07,59.3 99.07,61.54 100.24,62.71 U$5.A4
PWM_Y1
  Top 0.254: U$1.33 68.57,58.64 80.99,58.64 82.41,57.22 84.44,57.22 JP13.J1[33] 99.18,58.39 99.63,58.85 | U$5.A5 103.54,60.12 100.9,60.12 99.63,58.85 | 99.63,58.85 99.62,58.86
PWM_Z0
  Top 0.254: U$1.31 79.52,57.82 79.52,55.44 80.38,54.58 84.34,54.58 JP13.J1[31] 85.61,55.95 86.68,57.02 95.82,57.02 96.43,57.63 U$5.A6
PWM_Z1  (via drill 0.5)
  Top 0.254: U$1.15 74.87,47.92 74.87,36.72 77.33,34.26 84.34,34.26 JP13.J1[15] 86.93,35.53 v88.71,37.31 | v97.09,43.2 97.04,53.72 98.87,55.09 U$5.A7
  Bottom 0.254: v88.71,37.31 88.71,40.15 89.52,40.97 96.64,40.97 97.04,41.37 97.04,43.15 v97.09,43.2
SENSE0  (via drill 0.5)
  Top 0.254: U$1.2 58.94,43.02 58.94,38.58 v59.55,37.77 | v70.38,37.77 71.42,36.74 71.42,20.37 73.35,18.44 82.4,18.44 83.07,17.77 JP13.J1[2]
  Bottom 0.254: U$5.B21 100.19,19.53 98.67,21.05 88.71,21.05 86.68,19.02 84.44,19.02 83.17,17.75 JP13.J1[2] | v70.38,37.77 v59.55,37.77
SPI_CLK  (via drill 0.5, 0.6)
  Top 0.254: U$5.A8 98.52,52.55 v97.91,53.16 | v90.18,63.88 97.19,63.88 97.91,63.16 v97.91,60.22 | v62.29,61.49 62.29,60.62 U$1.38 v55.45,60.63
  Bottom 0.254: v97.91,60.22 v97.91,53.16 | v62.29,61.49 65.9,65.7 68.44,65.7 70.63,63.52 JP13.J1[38] 84.34,64.74 89.32,64.74 v90.18,63.88 | U$2.5 24.37,51.68 24.37,68.88 25.22,69.73 44.47,69.73 45.93,71.19 JP_SD.5 44.04,74.16 44.04,77.85 45.31,79.12 54.3,79.12 55.45,77.97 v55.45,60.63
SPI_CS0
  Top 0.254: R3.1 47.36,64.27 JP_SD.2
  Bottom 0.254: JP_SD.2 35.28,64.27 34.38,63.37 34.38,51.68 U$2.1
SPI_CS1
  Top 0.254: U$1.25 68.61,55.39 77.71,55.37 77.73,47.77 78.75,46.86 84.24,46.86 JP13.J1[25] 94.55,48.22 94.54,32.62 98.73,32.6 99.31,34.77 U$5.A15
SPI_CS2
  Top 0.254: U$1.23 77.18,54.62 77.18,45.38 78.14,44.42 84.34,44.42 JP13.J1[23] 86.73,46.81 93.94,46.81 93.94,32.12 103.54,32.12 U$5.A16
SPI_IN  (via drill 0.5)
  Top 0.254: U$1.32 52.46,58.22 v52.46,57.63 | U$5.A10 100.39,47.47 99.79,48.08 99.79,48.84 v97.91,50.72 | v95.21,55.75 95.16,55.8 v89.52,55.8
  Bottom 0.254: v52.46,57.63 80.74,57.63 80.74,56.87 81.75,55.85 JP13.J1[32] 84.24,57.02 88.51,57.02 89.32,56.2 v89.52,55.8 | v95.21,55.75 95.21,51.84 96.33,50.72 v97.91,50.72
SPI_OUT  (via drill 0.5, 0.6)
  Top 0.254: 60.3,58.95 U$1.34 55.86,59.02 v55.9,59.03 | U$5.A9 99.94,50.01 98.16,51.78 v97.88,51.85 | v90.08,60.47 90.29,60.27 v96.38,60.27 | v19.54,55.56 v31.83,55.56
  Bottom 0.254: v96.38,60.27 96.38,53.31 v97.88,51.85 | v90.08,60.47 89.93,60.47 89.12,59.66 84.34,59.66 JP13.J1[34] 82.51,58.95 v55.9,59.03 51.95,58.97 50.75,60.16 50.75,65.66 49.58,66.83 45.96,66.83 JP_SD.3 | JP_SD.3 46.91,66.81 47.93,67.99 47.97,76.19 47.24,76.97 JP_SD.7 | JP_SD.3 32.98,66.81 31.88,65.7 31.88,55.56 v31.83,55.56 31.83,51.68 31.88,51.68 U$2.2 | U$2.7 19.44,55.6 v19.54,55.56
U0_RXD  (via drill 0.5)
  Top 0.254: 60.36,55.04 U$1.24 56.85,55.02 56.85,52.83 v53.55,52.83 | v23.71,47.48 v20.04,47.52 | v33.26,44.85 33.36,45.05 33.3,45.1 v33.3,47.49
  Bottom 0.254: U1.5 28.27,34.03 28.75,34.6 28.75,44.81 28.73,44.83 v33.26,44.85 45.55,44.83 v53.55,52.83 | JP12.3 5.79,62.46 7.42,62.46 9.31,60.57 9.31,51 10.06,50.25 16.76,50.25 v20.04,47.52 | v33.3,47.49 33.29,47.48 v23.71,47.48
U0_TXD  (via drill 0.5)
  Top 0.254: U$1.26 56.37,55.82 56.37,54.53 v53.55,54.53 | v19.98,45.79 23.64,45.79 v23.69,45.84
  Bottom 0.254: U1.1 25.47,36.61 25.97,37.11 25.97,45.69 | 25.97,45.69 25.97,45.81 25.96,45.82 | JP12.2 7.11,59.93 8.76,58.29 8.76,50.62 9.35,49.68 15.49,49.68 v19.98,45.79 | v23.69,45.84 25.82,45.84 | 25.82,45.84 25.97,45.69 | v53.55,54.53 44.85,45.84 25.82,45.84
UART_RX  (via drill 0.5)
  Top 0.254: U$1.14 54.96,47.82 v54.93,47.8 | v88.76,33.8 88.51,34.06 85.26,34.06 84.19,32.99 JP13.J1[14] | v74.14,32.56 75.81,31.2 79.33,31.2 79.56,30.96 v80.48,30.96 | JP6.3 51.47,7.86 53.47,9.86 54.66,9.86 55.84,11.03 55.84,21.61 55.85,21.62 v55.85,22.66 | v70.17,32.68 66.18,32.68 v65.91,32.41 | v59.13,29.7 59.13,26.25 v57.83,25.16
  Bottom 0.254: v54.93,47.8 54.91,43.59 74.06,43.59 74.06,43.28 v74.14,32.56 70.25,32.6 v70.17,32.68 | v88.76,33.8 88.76,25.22 89.32,24.66 103.49,24.66 U$5.B19 | v80.48,30.96 80.48,32.05 81.41,32.98 JP13.J1[14] | v57.83,25.16 57.83,24.86 v55.85,22.66 | v59.13,29.7 59.16,29.73 59.16,31.52 59.27,31.63 65.45,31.63 65.91,32.1 v65.91,32.41
UART_TX  (via drill 0.5)
  Top 0.254: U$1.10 56.56,46.31 v56.5,46.24 | JP6.2 54.01,8.51 54.87,9.37 55.47,9.37 56.45,10.36 56.45,21.66 v56.8,22.01 | v74.11,26.34 75.49,27.71 82.87,27.71 JP13.J1[10] | v59.03,25.08 59.82,25.86 v59.96,28.72
  Bottom 0.254: v56.5,46.24 75.97,46.29 75.97,28.8 76.52,27.96 83.02,27.96 JP13.J1[10] 84.44,26.54 87.49,26.54 88.1,25.93 88.1,23.08 89.12,22.07 U$5.B20 | v56.8,22.01 59.07,24.27 v59.03,25.08 | v59.96,28.72 60.95,29.84 63.52,29.84 64.21,29.15 64.21,26.74 64.61,26.34 v74.11,26.34
USB0_DM
  Top 0.254: U$1.51 70.37,65.82 70.37,67.23 84.29,67.23 JP13.J1[41]
USB0_DP  (via drill 0.5)
  Top 0.254: U$1.52 58.63,66.22 v57.57,67.28 | v71.54,68.55 JP13.J1[42]
  Bottom 0.254: v57.57,67.28 58.69,68.5 v71.54,68.55
VDDA_DAC_ADC  (via drill 0.5)
  Top 0.254: v64.58,32.66 64.58,34.9 65.78,36.09 65.78,44.72 U$1.7 73.34,44.73 73.34,30.7 73.33,25.32 74.17,24.47 74.27,24.38 84.69,24.38 85.61,25.3 JP13.J1[7]
  Bottom 0.254: v64.58,32.66 50.96,32.66 JP14.2

### Text on the board
tPlace: AQUA URSA MAIN BOARD | M BUJOLD 2013 | PWR | GND | GND | 3V3 | TX | RX | 3V3 | 3V3 | GND